# Altium schematic sheet kt404c.schdoc
size 280 x 120 mm
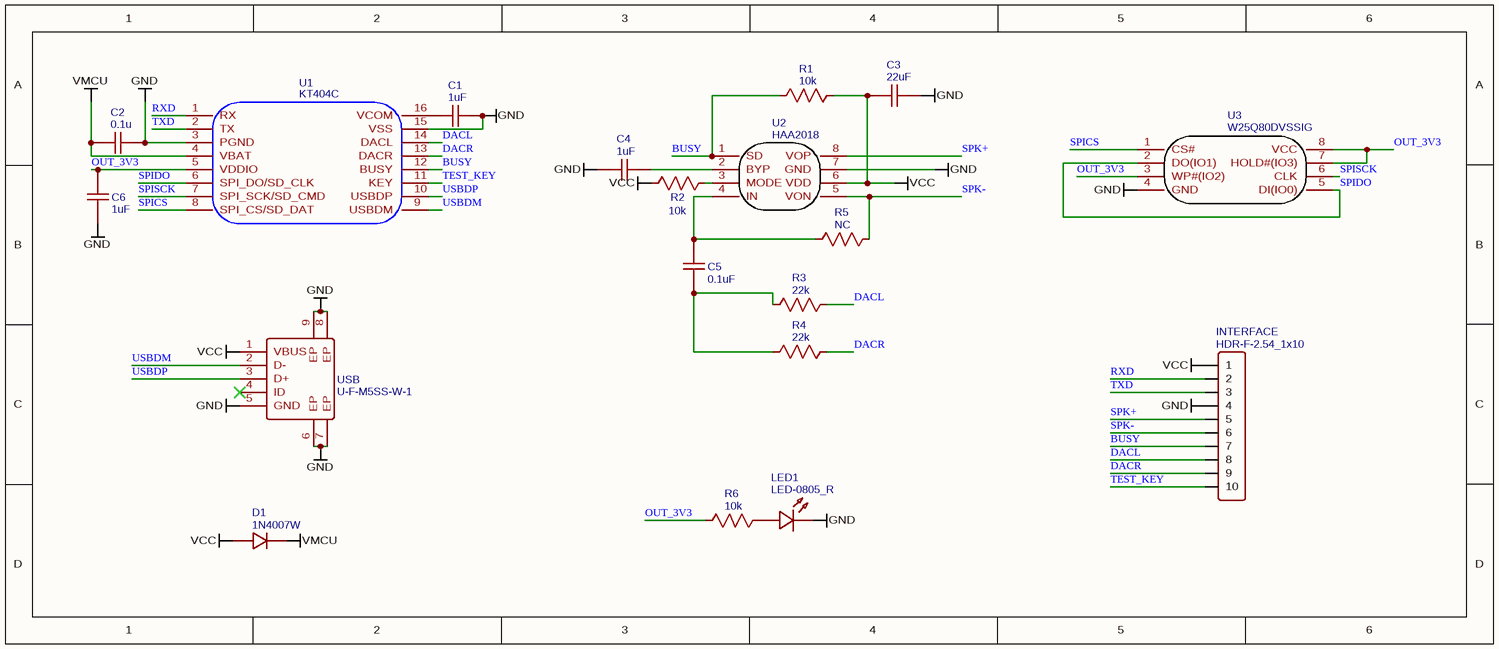
[diagram p0: kt404c.schdoc]

## Parts
C1  1uF  [C0805]
C2  0.1u  [C0805]
C3  22uF  [C0805]
C4  1uF  [C0805]
C5  0.1uF  [C0805]
C6  1uF  [C0805]
D1  1N4007W  [SOD-123_L2.8-W1.8-LS3.7-RD]
INTERFACE  HDR-F-2.54_1x10  [HDR-F-2.54_1X10]
LED1  LED-0805_R  [LED0805_RED]
R1  10k  [R0805]
R2  10k  [R0805]
R3  22k  [R0805]
R4  22k  [R0805]
R5  NC  [R0805]
R6  10k  [R0805]
U1  KT404C  [SOP16]
U2  HAA2018  [SOP8]
U3  W25Q80DVSSIG  [SOIC-8_L5.3-W5.3-P1.27-LS8.0-BL]
USB  U-F-M5SS-W-1  [MICRO-USB-SMD_MICRO-USB-A11]

## Nets
GND: C1.2 C2.2 C3.2 C4.1 C6.2 INTERFACE.4 LED1.2 U1.3(PGND) U1.15(VSS) U2.7(GND) U3.4(GND) USB.5(GND) USB.6(EP) USB.7(EP) USB.8(EP) USB.9(EP)
VCC: C3.1 D1.2 INTERFACE.1 R1.2 R2.1 U2.6(VDD) USB.1(VBUS)
VMCU: C2.1 D1.1 U1.4(VBAT)
BUSY: INTERFACE.7 R1.1 U1.12(BUSY) U2.1(SD)
DACL: INTERFACE.8 R3.2 U1.14(DACL)
DACR: INTERFACE.9 R4.2 U1.13(DACR)
OUT_3V3: C6.1 R6.1 U1.5(VDDIO) U3.3(WP#(IO2)) U3.7(HOLD#(IO3)) U3.8(VCC)
RXD: INTERFACE.2 U1.1(RX)
SPICS: U1.8(SPI_CS/SD_DAT) U3.1(CS#)
SPIDO: U1.6(SPI_DO/SD_CLK) U3.2(DO(IO1)) U3.5(DI(IO0))
SPISCK: U1.7(SPI_SCK/SD_CMD) U3.6(CLK)
SPK+: INTERFACE.5 U2.8(VOP)
SPK-: INTERFACE.6 R5.2 U2.5(VON)
TEST_KEY: INTERFACE.10 U1.11(KEY)
TXD: INTERFACE.3 U1.2(TX)
USBDM: U1.9(USBDM) USB.2(D-)
USBDP: U1.10(USBDP) USB.3(D+)
NetC1_1: C1.1 U1.16(VCOM)
NetC4_2: C4.2 U2.2(BYP)
NetC5_1: C5.1 R5.1 U2.4(IN)
NetC5_2: C5.2 R3.1 R4.1
NetLED1_1: LED1.1 R6.2
NetR2_2: R2.2 U2.3(MODE)

Not connected (* = marked no-connect by the designer): USB 4(ID)*

## Library data of the parts
C1 C4 C6 = 1uF: nameAlias: Value(F); Contributor: LCEDA_Lib; BOM_Supplier Part: C16834; BOM_Supplier: LCSC; spicePre: C; spiceSymbolName: C_0805_US
C2 = 0.1u: nameAlias: Value(F); Contributor: LCEDA_Lib; BOM_Supplier Part: C1760; BOM_Supplier: LCSC; spicePre: C; spiceSymbolName: C_0805_US
C3 = 22uF: nameAlias: Value(F); Contributor: LCEDA_Lib; BOM_Supplier Part: C385040; BOM_Supplier: LCSC; spicePre: C; spiceSymbolName: C_0805_US
C5 = 0.1uF: nameAlias: Value(F); Contributor: LCEDA_Lib; BOM_Supplier Part: C1760; BOM_Supplier: LCSC; spicePre: C; spiceSymbolName: C_0805_US
D1 = 1N4007W: BOM_Manufacturer: BLUE ROCKET; Contributor: LCEDA_Lib; BOM_Supplier: LCSC; BOM_Supplier Part: C328592; BOM_Manufacturer Part: 1N4007W; spicePre: D; spiceSymbolName: 1N4007W
INTERFACE = HDR-F-2.54_1x10: Contributor: LCEDA_Lib; BOM_Supplier Part: C57369; BOM_Supplier: LCSC; spicePre: H; spiceSymbolName: HDR-F-2.54_1x10
LED1 = LED-0805_R: BOM_Manufacturer: EVERLIGHT(台湾亿光); BOM_Manufacturer Part: 17-21SURC/S530-A3/TR8; Contributor: LCEDA_Lib; BOM_Supplier Part: C72037; spicePre: L; spiceSymbolName: LED-0805_R
R1 R2 R6 = 10k: nameAlias: Value(Ω); Contributor: LCEDA_Lib; BOM_Supplier Part: C2759650; BOM_Supplier: LCSC; spicePre: R; spiceSymbolName: R_0805_US
R3 R4 = 22k: nameAlias: Value(Ω); Contributor: LCEDA_Lib; BOM_Supplier Part: C114565; BOM_Supplier: LCSC; spicePre: R; spiceSymbolName: R_0805_US
R5 = NC: nameAlias: Value(Ω); Contributor: LCEDA_Lib; spicePre: R; spiceSymbolName: R_0805_US
U1 = KT404C: Contributor: BardYuan; spicePre: U; spiceSymbolName: KT404C
U2 = HAA2018: Contributor: xf1619; link: https://item.taobao.com/item.htm?spm=a230r.1.14.1.d89d5eabnOCq0V&id=627032207957&ns=1&abbucket=17#detail; spicePre: U; spiceSymbolName: HAA2018
U3 = W25Q80DVSSIG: BOM_Manufacturer: WINBOND; Package Display: No; BOM_Supplier: LCSC; BOM_Manufacturer Part: W25Q80DVSSIG; BOM_Supplier Part: C14086; BOM_JLCPCB Part Class: Extended Part; spicePre: U; spiceSymbolName: W25Q80DVSSIG
USB = U-F-M5SS-W-1: BOM_Manufacturer: HRO; Contributor: LCSC; BOM_Supplier: LCSC; BOM_Manufacturer Part: U-F-M5SS-W-1; BOM_Supplier Part: C145783; BOM_JLCPCB Part Class: Extended Part; spicePre: U; spiceSymbolName: U-F-M5SS-W-1